# Altium schematic sheet 3_MG32F003_QFN20 .SchDoc
size 292 x 220 mm; PageSetup: Record=PageOptions|CenterHorizontal=True|CenterVertical=True|PrintScale=0.94|XCorrection=1.00|YCorrection=1.00|PrintKind=0|BorderSize=5000000|LeftOffset=0|BottomOffset=0|Orientation=2|PaperLength=1000|PaperWidth=1000|Scale=100|PaperSource=7|PrintQuality=-4|MediaType=1|DitherType=10|PaperKind=A4 (210 x 297 mm)|PrintScaleMode=1
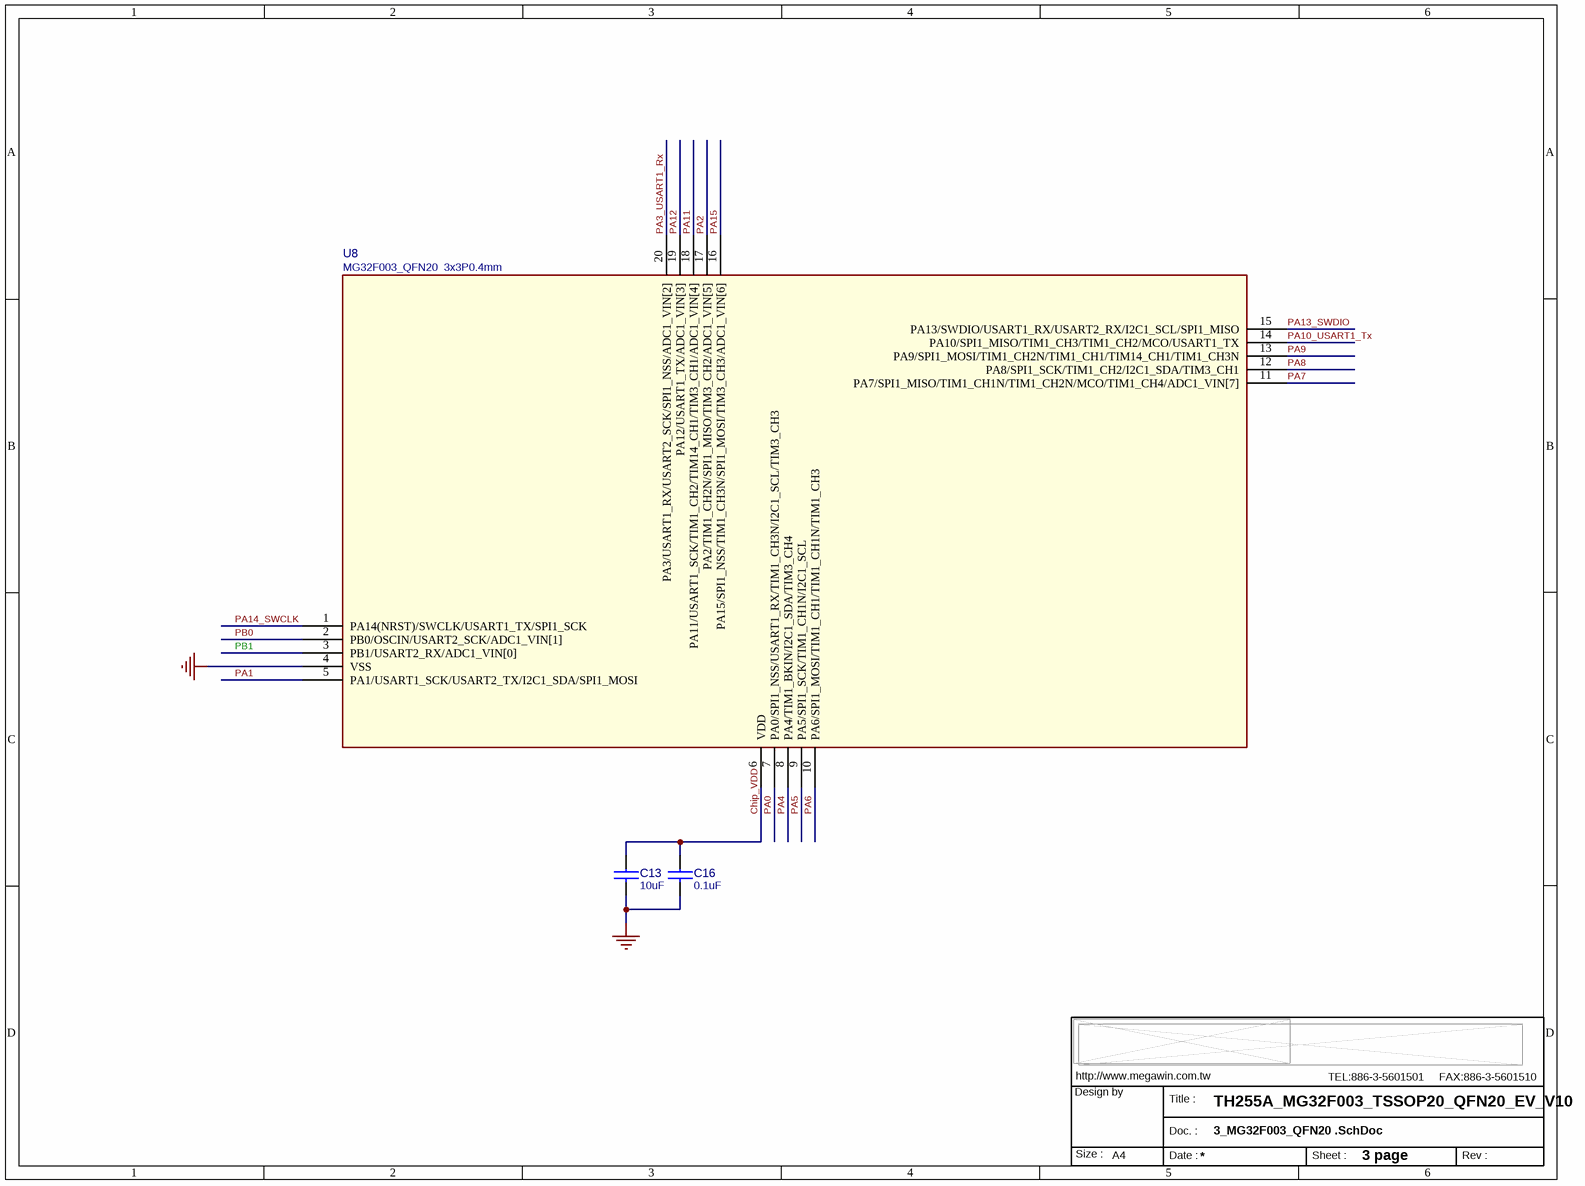
[diagram p0: 3_MG32F003_QFN20 .SchDoc]

## Parts
C13  10uF  [C-0603]
C16  0.1uF  [C-0603]
MW1  OrgAddr3: TEL:886-3-5601501     FAX:886-3-5601510  [MEGAWIN_3.4]  (hidden comment: MW-A4)  (graphical)
U8  MG32F003_QFN20  3x3P0.4mm  [QFN20_3X3P040_1]

## Nets
GND_POWER: C13.2 C16.2 U8.4(VSS)
Chip_VDD: C13.1 C16.1 U8.6(VDD)
PA0: U8.7(PA0/SPI1_NSS/USART1_RX/TIM1_CH3N/I2C1_SCL/TIM3_CH3)
PA1: U8.5(PA1/USART1_SCK/USART2_TX/I2C1_SDA/SPI1_MOSI)
PA2: U8.17(PA2/TIM1_CH2N/SPI1_MISO/TIM3_CH2/ADC1_VIN[5])
PA3_USART1_Rx: U8.20(PA3/USART1_RX/USART2_SCK/SPI1_NSS/ADC1_VIN[2])
PA4: U8.8(PA4/TIM1_BKIN/I2C1_SDA/TIM3_CH4)
PA5: U8.9(PA5/SPI1_SCK/TIM1_CH1N/I2C1_SCL)
PA6: U8.10(PA6/SPI1_MOSI/TIM1_CH1/TIM1_CH1N/TIM1_CH3)
PA7: U8.11(PA7/SPI1_MISO/TIM1_CH1N/TIM1_CH2N/MCO/TIM1_CH4/ADC1_VIN[7])
PA8: U8.12(PA8/SPI1_SCK/TIM1_CH2/I2C1_SDA/TIM3_CH1)
PA9: U8.13(PA9/SPI1_MOSI/TIM1_CH2N/TIM1_CH1/TIM14_CH1/TIM1_CH3N)
PA10_USART1_Tx: U8.14(PA10/SPI1_MISO/TIM1_CH3/TIM1_CH2/MCO/USART1_TX)
PA11: U8.18(PA11/USART1_SCK/TIM1_CH2/TIM14_CH1/TIM3_CH1/ADC1_VIN[4])
PA12: U8.19(PA12/USART1_TX/ADC1_VIN[3])
PA13_SWDIO: U8.15(PA13/SWDIO/USART1_RX/USART2_RX/I2C1_SCL/SPI1_MISO)
PA14_SWCLK: U8.1(PA14(NRST)/SWCLK/USART1_TX/SPI1_SCK)
PA15: U8.16(PA15/SPI1_NSS/TIM1_CH3N/SPI1_MOSI/TIM3_CH3/ADC1_VIN[6])
PB0: U8.2(PB0/OSCIN/USART2_SCK/ADC1_VIN[1])
PB1: U8.3(PB1/USART2_RX/ADC1_VIN[0])

## Notes on the sheet
- TH255A_MG32F003_TSSOP20_QFN20_EV_V10
- 3 page
- (in symbol MW_A4_2) Design by; Title :; Doc. :; Size :; A4; Date :; Sheet :; Rev :

## Library data of the parts
C13 C16 = CAP NP_Dup1
MW1 = MW_A4_2: Page Create Date: March  8, 1995; OrgAddr2: http://www.megawin.com.tw
U8 = MG32F003_QFN20